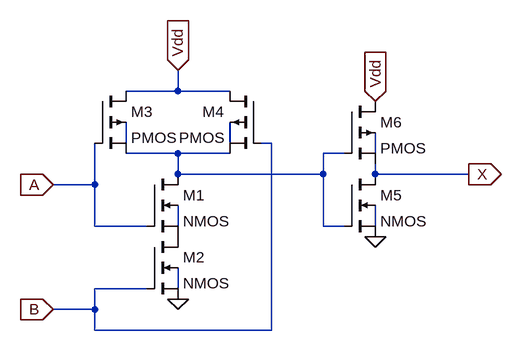
[diagram p0: schematic and_gate.asc]
and_gate.asc, the LTspice schematic file:
Version 4.1
SHEET 1 880 680
WIRE 192 -48 192 -80
WIRE 192 -48 112 -48
WIRE 272 -48 192 -48
WIRE 112 32 112 0
WIRE 272 32 272 0
WIRE 336 32 320 32
WIRE 192 48 112 48
WIRE 272 48 192 48
WIRE 448 48 416 48
WIRE 496 48 496 16
WIRE 192 80 192 48
WIRE 416 80 416 48
WIRE 416 80 192 80
WIRE 496 80 496 64
WIRE 640 80 496 80
WIRE 64 96 64 32
WIRE 64 96 0 96
WIRE 64 160 64 96
WIRE 144 160 64 160
WIRE 192 160 192 128
WIRE 416 160 416 80
WIRE 448 160 416 160
WIRE 496 160 496 128
WIRE 144 256 64 256
WIRE 192 256 192 224
WIRE 64 288 64 256
WIRE 64 288 0 288
WIRE 64 320 64 288
WIRE 336 320 336 32
WIRE 336 320 64 320
FLAG 192 272 0
FLAG 192 -80 Vdd
IOPIN 192 -80 In
FLAG 0 96 A
IOPIN 0 96 In
FLAG 0 288 B
IOPIN 0 288 In
FLAG 640 80 X
IOPIN 640 80 Out
FLAG 496 176 0
FLAG 496 -32 Vdd
IOPIN 496 -32 In
SYMBOL nmos4 144 80 R0
SYMATTR InstName M1
SYMBOL nmos4 144 176 R0
SYMATTR InstName M2
SYMBOL pmos4 64 -48 R0
SYMATTR InstName M3
SYMBOL pmos4 320 -48 M0
SYMATTR InstName M4
SYMBOL nmos4 448 80 R0
SYMATTR InstName M5
SYMBOL pmos4 448 -32 R0
SYMATTR InstName M6

The netlist it stands for:
* and_gate.asc
M1 N003 A P001 N005 NMOS
M2 P001 B 0 N007 NMOS
M3 Vdd A N003 N001 PMOS
M4 Vdd B N003 N002 PMOS
M5 X N003 0 N006 NMOS
M6 Vdd N003 X N004 PMOS
.model NMOS NMOS
.model PMOS PMOS
.lib standard.mos
.backanno
.end